# Altium schematic sheet 03_RFID.SchDoc
size A4
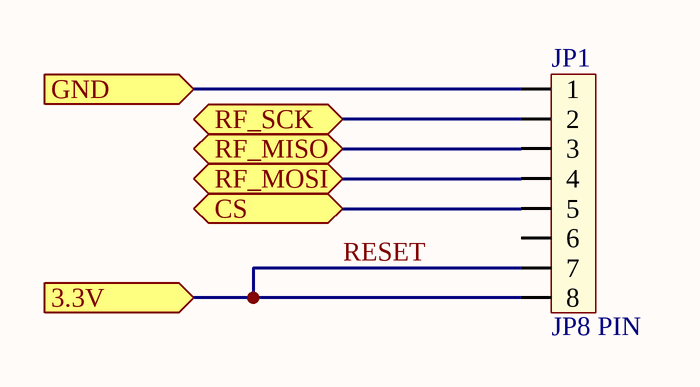
[diagram p0: 03_RFID.SchDoc]

## Parts
JP1  JP8 PIN  [JP8]

## Ports
3.3V (in), CS (bidir), GND (in), RF_MISO (bidir), RF_MOSI (bidir), RF_SCK (bidir)

## Nets
CS: JP1.5 ; port CS
GND: JP1.1 ; port GND
RESET: JP1.7 JP1.8 ; port 3.3V
RF_MISO: JP1.3 ; port RF_MISO
RF_MOSI: JP1.4 ; port RF_MOSI
RF_SCK: JP1.2 ; port RF_SCK

Not connected (* = marked no-connect by the designer): JP1 6

## Notes on the sheet
- Project:
- MANDevices
- Page Contents:
- Size:
- Date:
- A4
- Checked by:
- Time:
- Revision:
- Sheet
- of
- HaNoi University of
- Science and Technology
- File:

## Library data of the parts
JP1 = JP8: Value: JP7